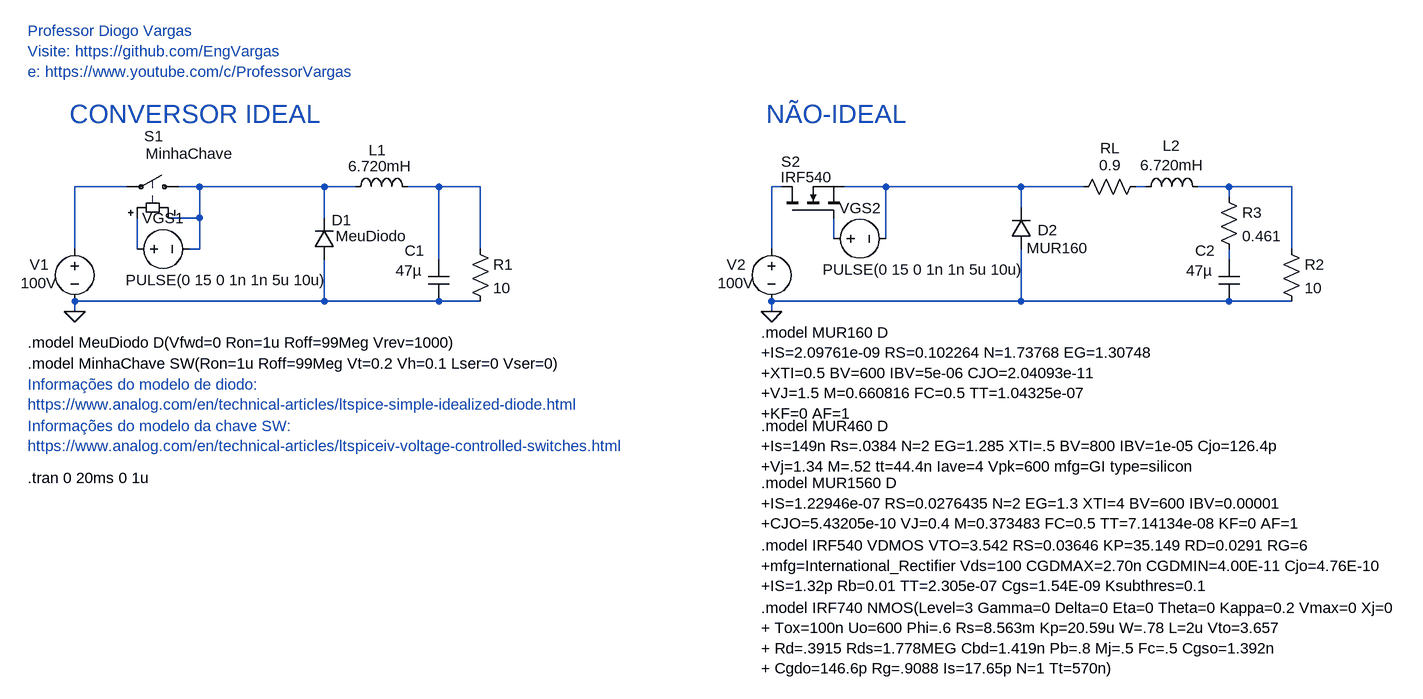
[diagram p0: schematic Conv-A11-PerdasBuck(LTspice).asc]
Conv-A11-PerdasBuck(LTspice).asc, the LTspice schematic file:
Version 4
SHEET 1 4752 680
WIRE 1056 -432 976 -432
WIRE 1168 -432 1136 -432
WIRE 1360 -432 1168 -432
WIRE 1408 -432 1360 -432
WIRE 1536 -432 1488 -432
WIRE 1600 -432 1536 -432
WIRE 2064 -432 2048 -432
WIRE 2224 -432 2160 -432
WIRE 2432 -432 2224 -432
WIRE 2528 -432 2432 -432
WIRE 2624 -432 2608 -432
WIRE 2752 -432 2704 -432
WIRE 2848 -432 2752 -432
WIRE 2752 -416 2752 -432
WIRE 2432 -400 2432 -432
WIRE 1168 -384 1168 -432
WIRE 1168 -384 1120 -384
WIRE 1360 -384 1360 -432
WIRE 2144 -352 2144 -384
WIRE 2224 -352 2224 -432
WIRE 976 -336 976 -432
WIRE 1072 -336 1072 -384
WIRE 1168 -336 1168 -384
WIRE 1168 -336 1152 -336
WIRE 1600 -336 1600 -432
WIRE 2048 -336 2048 -432
WIRE 2848 -336 2848 -432
WIRE 1536 -320 1536 -432
WIRE 2752 -320 2752 -336
WIRE 1360 -256 1360 -320
WIRE 1360 -256 976 -256
WIRE 1536 -256 1360 -256
WIRE 1600 -256 1536 -256
WIRE 2432 -256 2432 -336
WIRE 2432 -256 2048 -256
WIRE 2752 -256 2432 -256
WIRE 2848 -256 2752 -256
WIRE 976 -240 976 -256
WIRE 2048 -240 2048 -256
FLAG 2048 -240 0
FLAG 976 -240 0
SYMBOL voltage 2048 -352 R0
WINDOW 3 -83 68 Left 2
WINDOW 0 -69 40 Left 2
WINDOW 123 0 0 Left 0
WINDOW 39 0 0 Left 0
SYMATTR Value 100V
SYMATTR InstName V2
SYMBOL voltage 2128 -352 R270
WINDOW 0 32 56 VTop 2
WINDOW 3 -32 154 VBottom 2
WINDOW 123 0 0 Left 2
WINDOW 39 0 0 Left 2
SYMATTR InstName VGS2
SYMATTR Value PULSE(0 15 0 1n 1n 5u 10u)
SYMBOL nmos 2064 -384 R270
WINDOW 0 87 -1 VRight 2
WINDOW 3 63 -2 VRight 2
SYMATTR InstName S2
SYMATTR Value IRF540
SYMBOL ind 2608 -416 R270
WINDOW 0 64 55 VTop 2
WINDOW 3 34 56 VTop 2
SYMATTR InstName L2
SYMATTR Value 6.720mH
SYMBOL cap 2736 -320 R0
WINDOW 0 -36 -14 Left 2
WINDOW 3 -50 17 Left 2
SYMATTR InstName C2
SYMATTR Value 47µ
SYMBOL res 2832 -352 R0
SYMATTR InstName R2
SYMATTR Value 10
SYMBOL diode 2448 -336 R180
WINDOW 0 -40 29 Left 2
WINDOW 3 -88 2 Left 2
SYMATTR InstName D2
SYMATTR Value MUR160
SYMBOL voltage 976 -352 R0
WINDOW 3 -83 68 Left 2
WINDOW 0 -69 40 Left 2
WINDOW 123 0 0 Left 0
WINDOW 39 0 0 Left 0
SYMATTR Value 100V
SYMATTR InstName V1
SYMBOL voltage 1056 -336 R270
WINDOW 0 32 56 VTop 2
WINDOW 3 -32 154 VBottom 2
WINDOW 123 0 0 Left 2
WINDOW 39 0 0 Left 2
SYMATTR InstName VGS1
SYMATTR Value PULSE(0 15 0 1n 1n 5u 10u)
SYMBOL ind 1392 -416 R270
WINDOW 0 57 50 VTop 2
WINDOW 3 32 54 VTop 2
SYMATTR InstName L1
SYMATTR Value 6.720mH
SYMBOL cap 1520 -320 R0
WINDOW 0 -36 -14 Left 2
WINDOW 3 -50 17 Left 2
SYMATTR InstName C1
SYMATTR Value 47µ
SYMBOL res 1584 -352 R0
SYMATTR InstName R1
SYMATTR Value 10
SYMBOL diode 1376 -320 R180
WINDOW 0 -26 61 Left 2
WINDOW 3 -112 36 Left 2
SYMATTR InstName D1
SYMATTR Value MeuDiodo
SYMBOL sw 1152 -432 M270
WINDOW 0 78 69 VLeft 2
WINDOW 3 51 67 VLeft 2
SYMATTR InstName S1
SYMATTR Value MinhaChave
SYMBOL res 2736 -432 R0
SYMATTR InstName R3
SYMATTR Value 0.461
SYMBOL res 2624 -448 R90
WINDOW 0 -28 55 VBottom 2
WINDOW 3 -2 55 VBottom 2
SYMATTR InstName RL
SYMATTR Value 0.9
TEXT 904 16 Left 2 !.tran 0 20ms 0 1u
TEXT 2032 24 Left 2 !.model MUR1560 D\n+IS=1.22946e-07 RS=0.0276435 N=2 EG=1.3 XTI=4 BV=600 IBV=0.00001\n+CJO=5.43205e-10 VJ=0.4 M=0.373483 FC=0.5 TT=7.14134e-08 KF=0 AF=1
TEXT 904 -672 Left 2 ;Professor Diogo Vargas\nVisite: https://github.com/EngVargas\ne: https://www.youtube.com/c/ProfessorVargas
TEXT 904 -192 Left 2 !.model MeuDiodo D(Vfwd=0 Ron=1u Roff=99Meg Vrev=1000)
TEXT 904 -160 Left 2 !.model MinhaChave SW(Ron=1u Roff=99Meg Vt=0.2 Vh=0.1 Lser=0 Vser=0)
TEXT 904 -64 Left 2 ;Informações do modelo da chave SW:\nhttps://www.analog.com/en/technical-articles/ltspiceiv-voltage-controlled-switches.html
TEXT 904 -128 Left 2 ;Informações do modelo de diodo:\nhttps://www.analog.com/en/technical-articles/ltspice-simple-idealized-diode.html
TEXT 2032 216 Left 2 !.model IRF740 NMOS(Level=3 Gamma=0 Delta=0 Eta=0 Theta=0 Kappa=0.2 Vmax=0 Xj=0\n+ Tox=100n Uo=600 Phi=.6 Rs=8.563m Kp=20.59u W=.78 L=2u Vto=3.657\n+ Rd=.3915 Rds=1.778MEG Cbd=1.419n Pb=.8 Mj=.5 Fc=.5 Cgso=1.392n\n+ Cgdo=146.6p Rg=.9088 Is=17.65p N=1 Tt=570n)
TEXT 2032 -208 Left 2 !.model MUR160 D\n+IS=2.09761e-09 RS=0.102264 N=1.73768 EG=1.30748\n+XTI=0.5 BV=600 IBV=5e-06 CJO=2.04093e-11\n+VJ=1.5 M=0.660816 FC=0.5 TT=1.04325e-07\n+KF=0 AF=1
TEXT 968 -544 Left 4 ;CONVERSOR IDEAL
TEXT 2040 -544 Left 4 ;NÃO-IDEAL
TEXT 2032 120 Left 2 !.model IRF540 VDMOS VTO=3.542 RS=0.03646 KP=35.149 RD=0.0291 RG=6\n+mfg=International_Rectifier Vds=100 CGDMAX=2.70n CGDMIN=4.00E-11 Cjo=4.76E-10\n+IS=1.32p Rb=0.01 TT=2.305e-07 Cgs=1.54E-09 Ksubthres=0.1
TEXT 2032 -64 Left 2 !.model MUR460 D\n+Is=149n Rs=.0384 N=2 EG=1.285 XTI=.5 BV=800 IBV=1e-05 Cjo=126.4p\n+Vj=1.34 M=.52 tt=44.4n Iave=4 Vpk=600 mfg=GI type=silicon

The netlist it stands for:
* Conv-A11-PerdasBuck(LTspice).asc
V2 N004 0 100V
VGS2 N008 N005 PULSE(0 15 0 1n 1n 5u 10u)
M§S2 N004 N008 N005 N005 IRF540
L2 N006 N007 6.720mH
C2 N010 0 47µ
R2 N007 0 10
D2 0 N005 MUR160
V1 N001 0 100V
VGS1 N009 N002 PULSE(0 15 0 1n 1n 5u 10u)
L1 N002 N003 6.720mH
C1 N003 0 47µ
R1 N003 0 10
D1 0 N002 MeuDiodo
S1 N002 N001 N009 N002 MinhaChave
R3 N007 N010 0.461
RL N006 N005 0.9
.model D D
.lib standard.dio
.model NMOS NMOS
.model PMOS PMOS
.lib standard.mos
.tran 0 20ms 0 1u
.model MUR1560 D
+IS=1.22946e-07 RS=0.0276435 N=2 EG=1.3 XTI=4 BV=600 IBV=0.00001
+CJO=5.43205e-10 VJ=0.4 M=0.373483 FC=0.5 TT=7.14134e-08 KF=0 AF=1
* Professor Diogo Vargas
* Visite: https://github.com/EngVargas
* e: https://www.youtube.com/c/ProfessorVargas
.model MeuDiodo D(Vfwd=0 Ron=1u Roff=99Meg Vrev=1000)
.model MinhaChave SW(Ron=1u Roff=99Meg Vt=0.2 Vh=0.1 Lser=0 Vser=0)
* Informações do modelo da chave SW:
* https://www.analog.com/en/technical-articles/ltspiceiv-voltage-controlled-switches.html
* Informações do modelo de diodo:
* https://www.analog.com/en/technical-articles/ltspice-simple-idealized-diode.html
.model IRF740 NMOS(Level=3 Gamma=0 Delta=0 Eta=0 Theta=0 Kappa=0.2 Vmax=0 Xj=0
+ Tox=100n Uo=600 Phi=.6 Rs=8.563m Kp=20.59u W=.78 L=2u Vto=3.657
+ Rd=.3915 Rds=1.778MEG Cbd=1.419n Pb=.8 Mj=.5 Fc=.5 Cgso=1.392n
+ Cgdo=146.6p Rg=.9088 Is=17.65p N=1 Tt=570n)
.model MUR160 D
+IS=2.09761e-09 RS=0.102264 N=1.73768 EG=1.30748
+XTI=0.5 BV=600 IBV=5e-06 CJO=2.04093e-11
+VJ=1.5 M=0.660816 FC=0.5 TT=1.04325e-07
+KF=0 AF=1
* CONVERSOR IDEAL
* NÃO-IDEAL
.model IRF540 VDMOS VTO=3.542 RS=0.03646 KP=35.149 RD=0.0291 RG=6
+mfg=International_Rectifier Vds=100 CGDMAX=2.70n CGDMIN=4.00E-11 Cjo=4.76E-10
+IS=1.32p Rb=0.01 TT=2.305e-07 Cgs=1.54E-09 Ksubthres=0.1
.model MUR460 D
+Is=149n Rs=.0384 N=2 EG=1.285 XTI=.5 BV=800 IBV=1e-05 Cjo=126.4p
+Vj=1.34 M=.52 tt=44.4n Iave=4 Vpk=600 mfg=GI type=silicon
.backanno
.end